# Altium schematic sheet rf_swrmet.SchDoc: mcHF Pro Transceiver RF board
size A3; Author: Krassi Atanassov; CompanyName: MØNKA; Engineer: For radio amateurs experimentation, non-commercial use only. Thank you!; Revision: 0.8.5; SheetTotal: 14
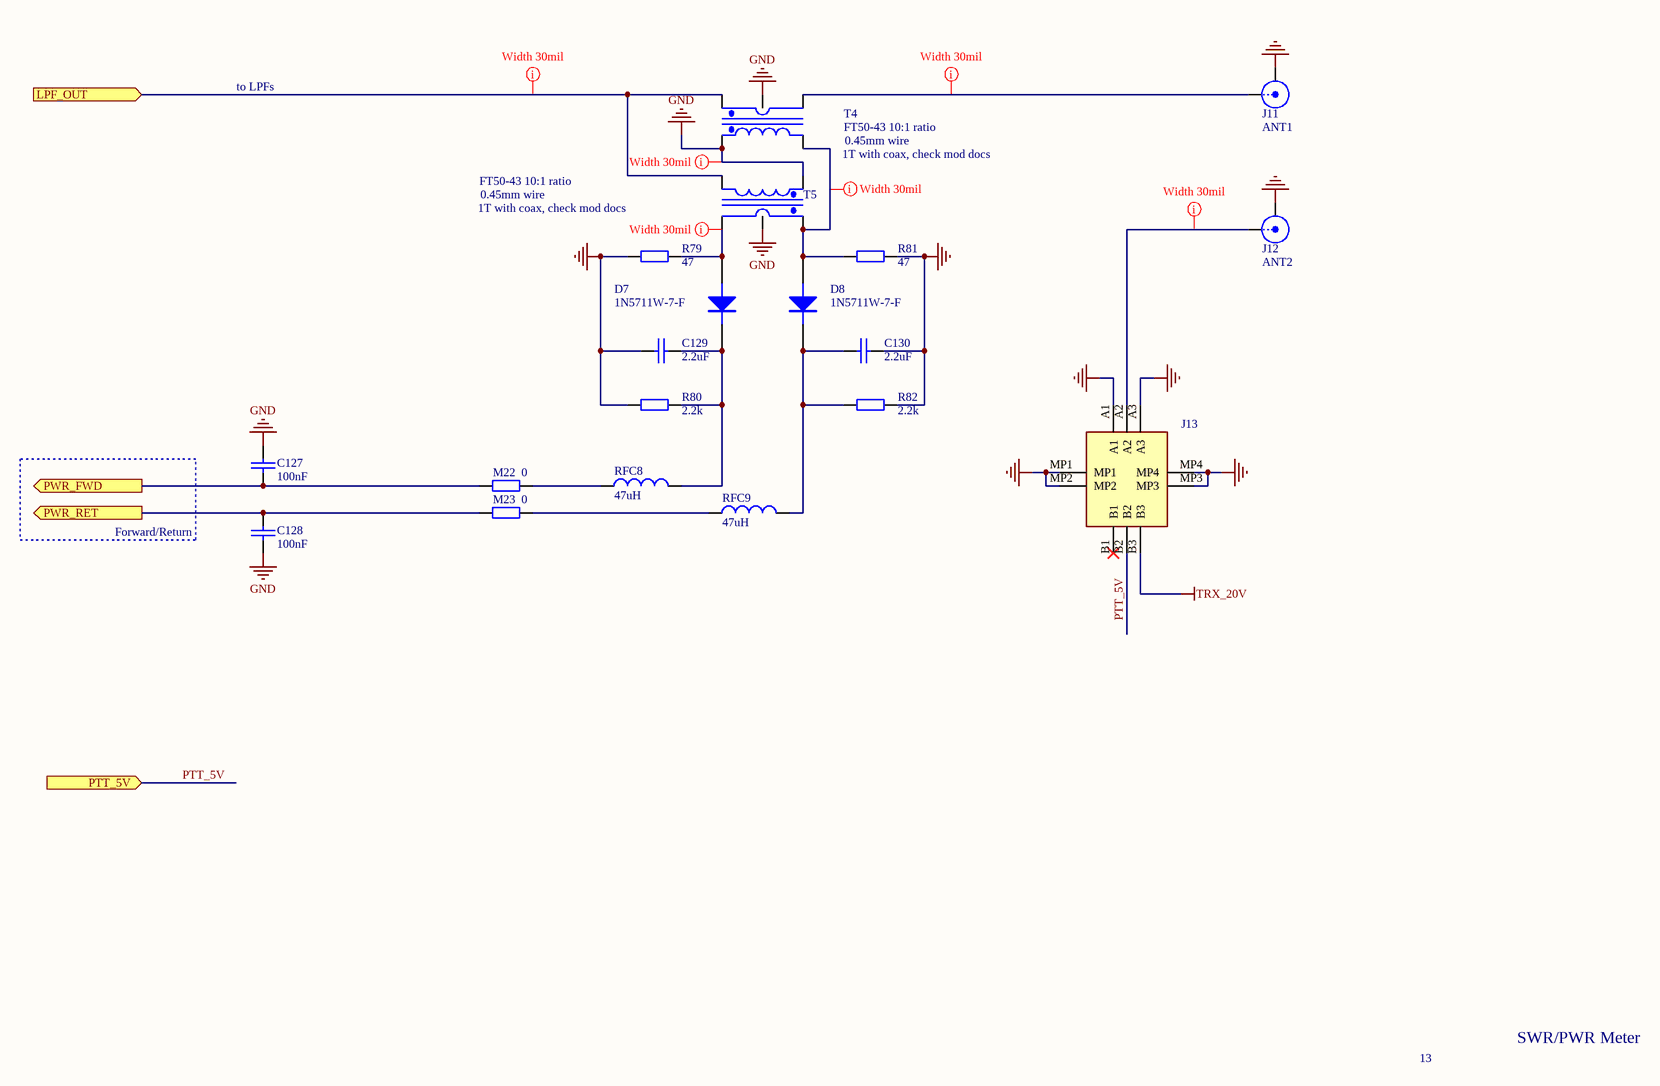
[diagram p0: rf_swrmet.SchDoc]

## Parts
C127  100nF  [0805]
C128  100nF  [0805]
C129  2.2uF  [0805]
C130  2.2uF  [0805]
D7  1N5711W-7-F  [SOD87]
D8  1N5711W-7-F  [SOD87]
J11  ANT1  [CON-SMA-RA]
J12  ANT2  [CON-SMA-RA]
J13  1373826  [1373826]  (value not drawn)
M22  0  [0805]
M23  0  [0805]
R79  47  [0805]
R80  2.2k  [0805]
R81  47  [0805]
R82  2.2k  [0805]
RFC8  47uH  [0805]
RFC9  47uH  [0805]
T4  FT50-43 10:1 ratio  [SWR_TR _new]
T5  FT50-43 10:1 ratio  [SWR_TR _new]

## Ports
LPF_OUT (in), PTT_5V (in), PWR_FWD (out), PWR_RET (out)

## Nets
GND: C127.1 C128.2 C129.1 C130.2 J11.2(Y) J12.2(Y) J13.A1 J13.A3 J13.MP1 J13.MP2 J13.MP3 J13.MP4 R79.1 R80.1 R81.2 R82.2 T4.1(Pri+) T4.5(Shield) T5.1(Pri+) T5.5(Shield)
TRX_20V: J13.B3
LPF_OUT: T4.3(Sec+) T5.2(Pri-) ; port LPF_OUT
PTT_5V: J13.B2 ; port PTT_5V
PWR_FWD: C127.2 M22.2 ; port PWR_FWD
PWR_RET: C128.1 M23.2 ; port PWR_RET
NetC129_2: C129.2 D7.2(K) R80.2 RFC8.2
NetC130_1: C130.1 D8.2(K) R82.1 RFC9.2
NetD7_1: D7.1(A) R79.2 T5.4(Sec-)
NetD8_1: D8.1(A) R81.1 T4.2(Pri-) T5.3(Sec+)
NetJ11_1: J11.1(X) T4.4(Sec-)
NetJ12_1: J12.1(X) J13.A2
NetM22_1: M22.1 RFC8.1
NetM23_1: M23.1 RFC9.1

Not connected (* = marked no-connect by the designer): J13 B1*

## Layout directives
rule Width Constraint [Pref Width = 30mil    Min Width = 30mil    Max Width = 30mil]: GND, LPF_OUT, NetD7_1, NetD8_1, NetJ11_1, NetJ12_1

## Notes on the sheet
- to LPFs
- 0.45mm wire
- 1T with coax, check mod docs
- (near R79) 1T with coax, check mod docs
- Forward/Return
- 13
- SWR/PWR Meter
- Date:
- File:
- Revision:
- Sheet
- of
- Licence:

## Library data of the parts
C127 C128 = CAP: Capacitor; QT Order: QCC-00154; Price: 0.068
C129 C130 = CAP: Capacitor; QT Order: QCC-00103; Price: 0.115
D7 D8 = PMEG6010CEH: RF DIODE SCHOTTKY 70V, SOD-123F; Order: DK 1N5711W-FDITR-ND; QT Order: QCD-00034; Price: 0.085
J11 J12 = BNC: RF COAXIAL, BNC, JACK; Order: FN 171-2350; Price: 0.69
J13 = 1373826: SMD male connector, nominal current: 2.2 A, Test voltage: 840 VAC, number of positions: 6, pitch: 1.27 mm, color: black, contact surface: Gold, type of contact: Male connector, mounting: SMD soldering; Manufacturer_Name: Phoenix Contact; Geometry.Height: 6.75mm; Mouser Part Number: 651-1373826; Mouser Price/Stock: https://www.mouser.co.uk/ProductDetail/Phoenix-Contact/1373826?qs=2SLPxufLcgB13Clq%252BEBMrA%3D%3D; Manufacturer_Part_Number: 1373826; Datasheet Link: http://www.phoenixcontact.com/gb/produkte/1373826
M22 M23 = RES: Resistor; QT Order: QCR-00268; Price: 0.009
R79 R81 = RES: Resistor; QT Order: QCR-00293; Price: 0.052
R80 R82 = RES: Resistor; QT Order: QCR-00333; Price: 0.046
RFC8 RFC9 = TDK-NLV25T: INDUCTOR, SIGNAL LINE, 47UH, 1005; Price: 0.166
T4 T5 = SWR_TR: SWR Bridge transformer; Notes: post assembly; Price: 0.795